# EAGLE schematic backplane_v1.0-smd (EAGLE 6.6.0)
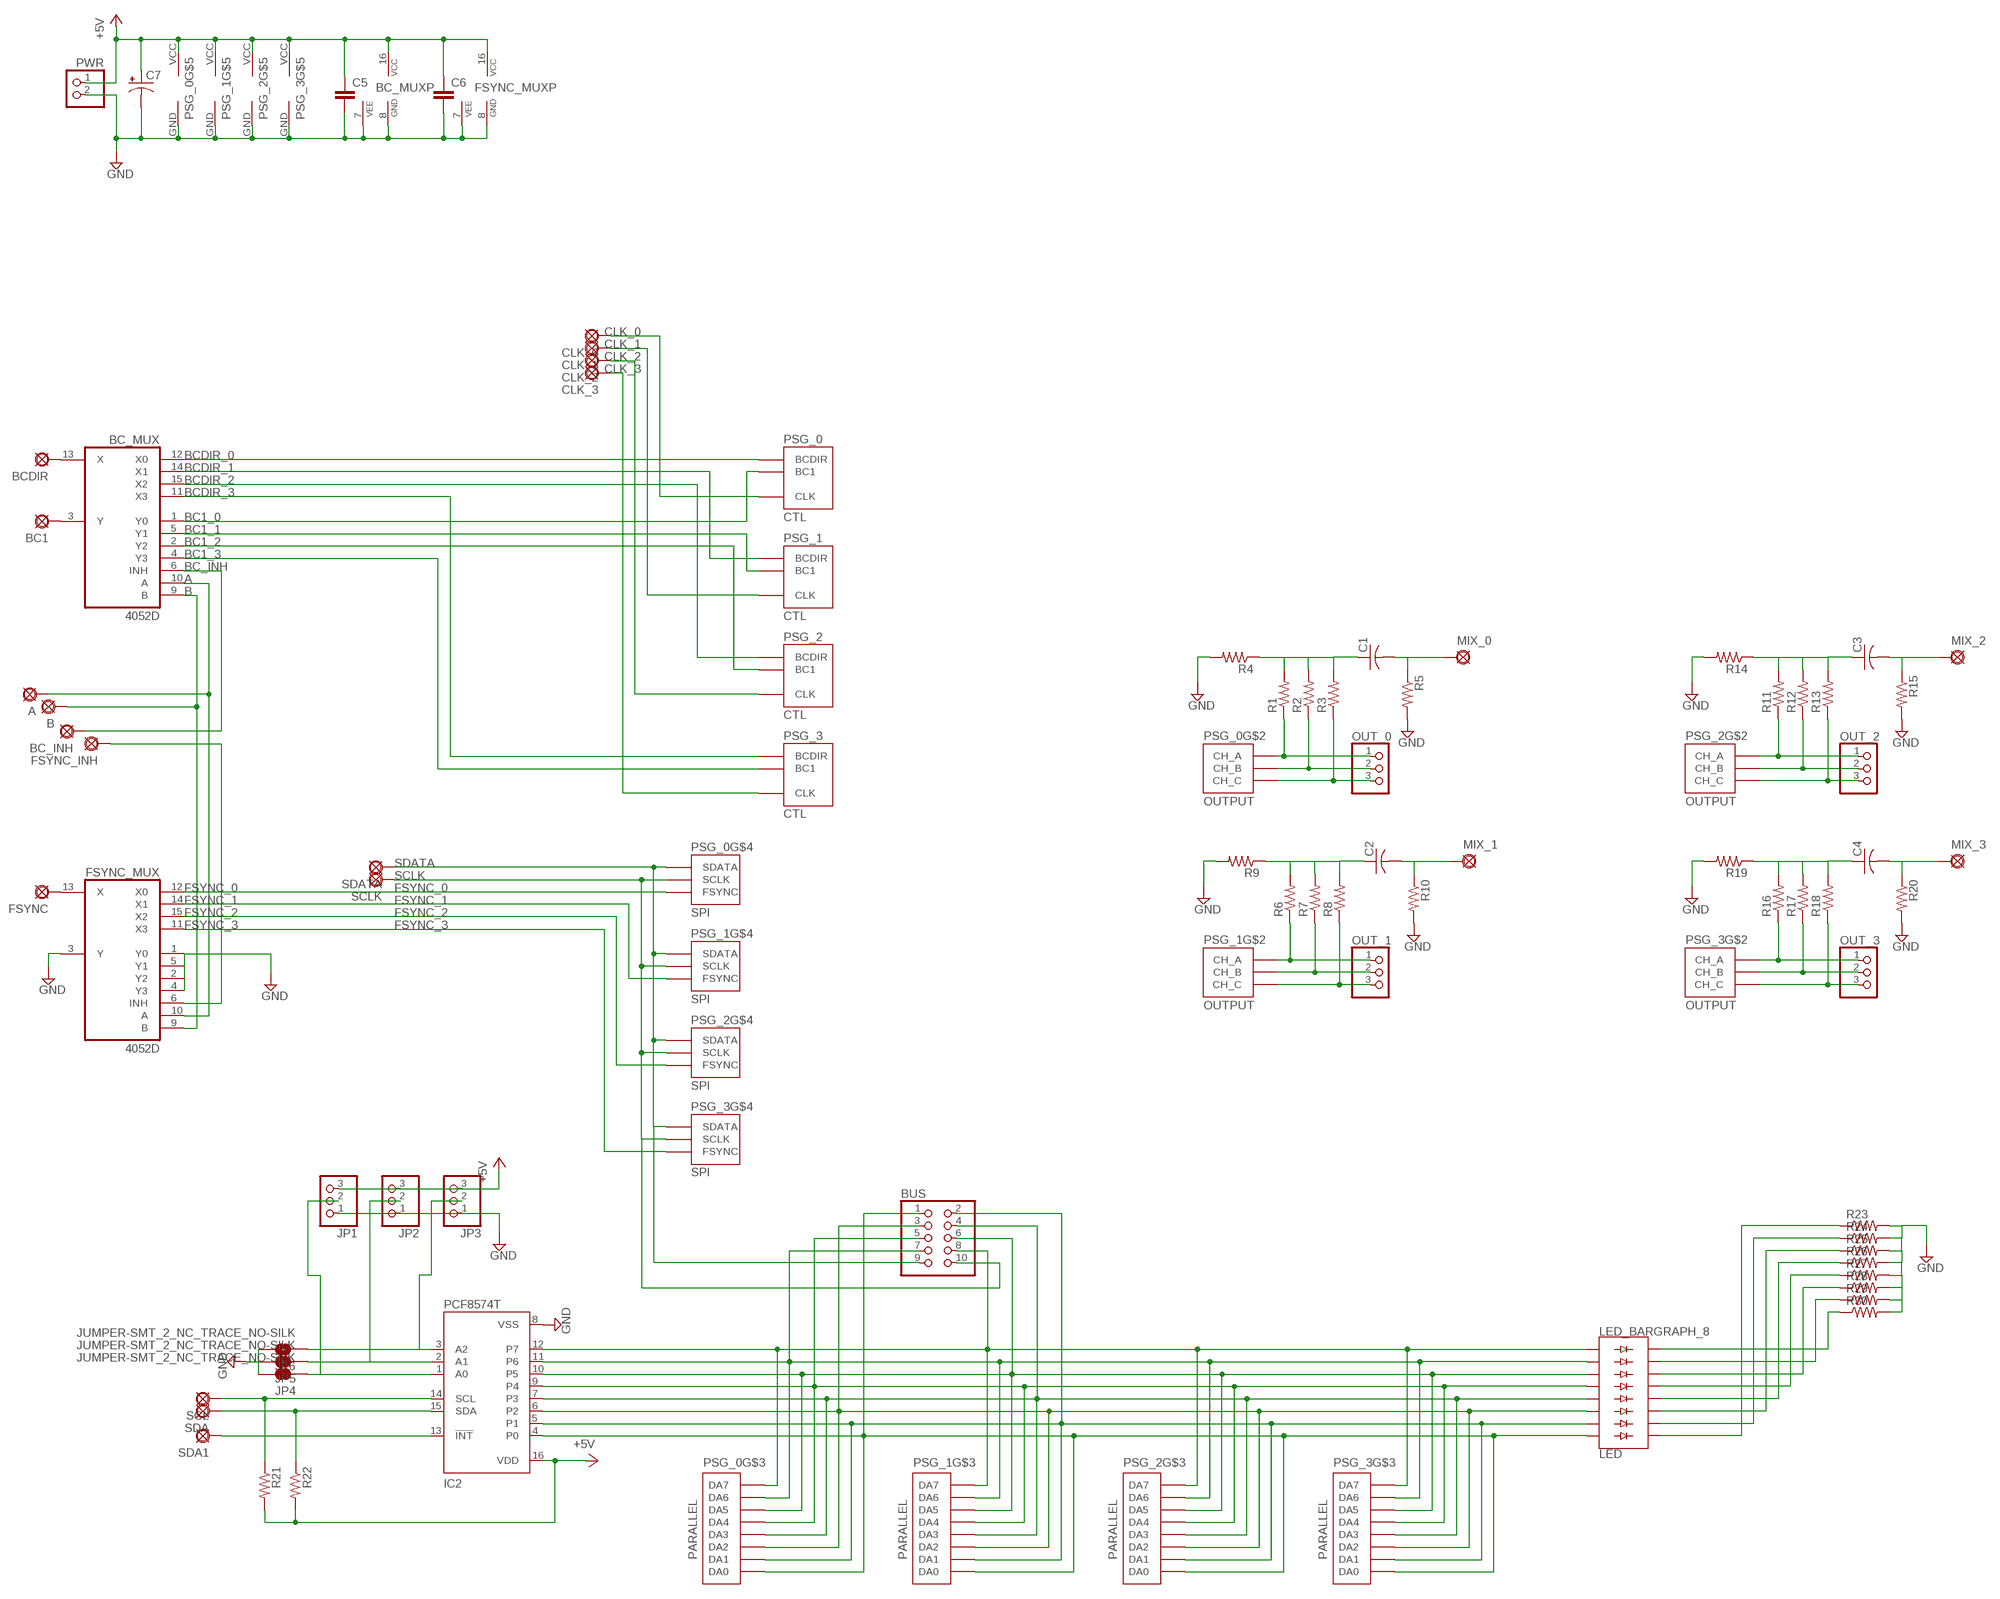
[diagram p0: schematic, sheet 1]

## Parts
A  PAD  [SQUARE]
B  PAD  [SQUARE]
BC1  PAD  [SQUARE]
BC_INH  PAD  [SQUARE]
BC_MUX  4052D  [SO16]
BCDIR  PAD  [SQUARE]
BUS  PINHD-2X5IDC  [10PIN_IDC]
C1  C-USC0805  [C0805]
C2  C-USC0805  [C0805]
C3  C-USC0805  [C0805]
C4  C-USC0805  [C0805]
C5  050X030_0251  [050X030_025]
C6  050X030_0251  [050X030_025]
C7  0631  [063_025]
CLK_0  PAD  [SQUARE]
CLK_1  PAD  [SQUARE]
CLK_2  PAD  [SQUARE]
CLK_3  PAD  [SQUARE]
FSYNC  PAD  [SQUARE]
FSYNC_INH  PAD  [SQUARE]
FSYNC_MUX  4052D  [SO16]
IC2  PCF8574T  [SO16W]
JP1  PINHD-1X3  [1X03]
JP2  PINHD-1X3  [1X03]
JP3  PINHD-1X3  [1X03]
JP4  JUMPER-SMT_2_NC_TRACE_NO-SILK  [SMT-JUMPER_2_NC_TRACE_NO-SILK]
JP5  JUMPER-SMT_2_NC_TRACE_NO-SILK  [SMT-JUMPER_2_NC_TRACE_NO-SILK]
JP6  JUMPER-SMT_2_NC_TRACE_NO-SILK  [SMT-JUMPER_2_NC_TRACE_NO-SILK]
LED  LED_BARGRAPH_8  [LED_BARGRAPH_8]
MIX_0  PAD  [SQUARE]
MIX_1  PAD  [SQUARE]
MIX_2  PAD  [SQUARE]
MIX_3  PAD  [SQUARE]
OUT_0  PINHD-1X3  [1X03]
OUT_1  PINHD-1X3  [1X03]
OUT_2  PINHD-1X3  [1X03]
OUT_3  PINHD-1X3  [1X03]
PSG_0  PSG_DAUGHTER  [PSG_DAUGHTER]
PSG_1  PSG_DAUGHTER  [PSG_DAUGHTER]
PSG_2  PSG_DAUGHTER  [PSG_DAUGHTER]
PSG_3  PSG_DAUGHTER  [PSG_DAUGHTER]
PWR  PINHD-1X2  [1X02]
R1  R-US_R0805  [R0805]
R2  R-US_R0805  [R0805]
R3  R-US_R0805  [R0805]
R4  R-US_R0805  [R0805]
R5  R-US_R0805  [R0805]
R6  R-US_R0805  [R0805]
R7  R-US_R0805  [R0805]
R8  R-US_R0805  [R0805]
R9  R-US_R0805  [R0805]
R10  R-US_R0805  [R0805]
R11  R-US_R0805  [R0805]
R12  R-US_R0805  [R0805]
R13  R-US_R0805  [R0805]
R14  R-US_R0805  [R0805]
R15  R-US_R0805  [R0805]
R16  R-US_R0805  [R0805]
R17  R-US_R0805  [R0805]
R18  R-US_R0805  [R0805]
R19  R-US_R0805  [R0805]
R20  R-US_R0805  [R0805]
R21  R-US_R0805  [R0805]
R22  R-US_R0805  [R0805]
R23  R-US_R0805  [R0805]
R24  R-US_R0805  [R0805]
R25  R-US_R0805  [R0805]
R26  R-US_R0805  [R0805]
R27  R-US_R0805  [R0805]
R28  R-US_R0805  [R0805]
R29  R-US_R0805  [R0805]
R30  R-US_R0805  [R0805]
SCL  PAD  [SQUARE]
SCLK  PAD  [SQUARE]
SDA  PAD  [SQUARE]
SDA1  PAD  [SQUARE]
SDATA  PAD  [SQUARE]

## Nets
+5V: BC_MUX.16(VCC) C5.1 C6.1 C7.+ FSYNC_MUX.16(VCC) IC2.16(VDD) JP1.3 JP2.3 JP3.3 PSG_0.VCC PSG_1.VCC PSG_2.VCC PSG_3.VCC PWR.1 R21.2 R22.2
A: A.1(PAD) BC_MUX.10(A) FSYNC_MUX.10(A)
A0: IC2.1(A0) JP1.2 JP4.1
A1: IC2.2(A1) JP2.2 JP5.1
A2: IC2.3(A2) JP3.2 JP6.1
B: B.1(PAD) BC_MUX.9(B) FSYNC_MUX.9(B)
BC1_0: BC_MUX.1(Y0) PSG_0.BC1
BC1_1: BC_MUX.5(Y1) PSG_1.BC1
BC1_2: BC_MUX.2(Y2) PSG_2.BC1
BC1_3: BC_MUX.4(Y3) PSG_3.BC1
BC_INH: BC_INH.1(PAD) BC_MUX.6(INH)
BCDIR_0: BC_MUX.12(X0) PSG_0.BCDIR
BCDIR_1: BC_MUX.14(X1) PSG_1.BCDIR
BCDIR_2: BC_MUX.15(X2) PSG_2.BCDIR
BCDIR_3: BC_MUX.11(X3) PSG_3.BCDIR
CLK_0: CLK_0.1(PAD) PSG_0.CLK
CLK_1: CLK_1.1(PAD) PSG_1.CLK
CLK_2: CLK_2.1(PAD) PSG_2.CLK
CLK_3: CLK_3.1(PAD) PSG_3.CLK
FSYNC: FSYNC.1(PAD) FSYNC_MUX.13(X)
FSYNC_0: FSYNC_MUX.12(X0) PSG_0.FSYNC
FSYNC_1: FSYNC_MUX.14(X1) PSG_1.FSYNC
FSYNC_2: FSYNC_MUX.15(X2) PSG_2.FSYNC
FSYNC_3: FSYNC_MUX.11(X3) PSG_3.FSYNC
FSYNC_INH: FSYNC_INH.1(PAD) FSYNC_MUX.6(INH)
GND: BC_MUX.7(VEE) BC_MUX.8(GND) C5.2 C6.2 C7.- FSYNC_MUX.1(Y0) FSYNC_MUX.2(Y2) FSYNC_MUX.3(Y) FSYNC_MUX.4(Y3) FSYNC_MUX.5(Y1) FSYNC_MUX.7(VEE) FSYNC_MUX.8(GND) IC2.8(VSS) JP1.1 JP2.1 JP3.1 JP4.2 JP5.2 JP6.2 PSG_0.GND PSG_1.GND PSG_2.GND PSG_3.GND PWR.2 R4.2 R5.2 R9.2 R10.2 R14.2 R15.2 R19.2 R20.2 R23.2 R24.2 R25.2 R26.2 R27.2 R28.2 R29.2 R30.2
N$1: C1.1 R1.2 R2.2 R3.2 R4.1
N$2: BC_MUX.13(X) BCDIR.1(PAD)
N$3: BC1.1(PAD) BC_MUX.3(Y)
N$4: IC2.14(SCL) R21.1 SCL.1(PAD)
N$5: C1.2 MIX_0.1(PAD) R5.1
N$6: IC2.15(SDA) R22.1 SDA.1(PAD)
N$8: C2.1 R6.2 R7.2 R8.2 R9.1
N$9: C2.2 MIX_1.1(PAD) R10.1
N$12: IC2.13(!INT) SDA1.1(PAD)
N$13: C3.1 R11.2 R12.2 R13.2 R14.1
N$14: C3.2 MIX_2.1(PAD) R15.1
N$15: LED.C7 R30.1
N$16: BUS.8 IC2.12(P7) LED.A7 PSG_0.DA7 PSG_1.DA7 PSG_2.DA7 PSG_3.DA7
N$17: BUS.1 IC2.4(P0) LED.A0 PSG_0.DA0 PSG_1.DA0 PSG_2.DA0 PSG_3.DA0
N$18: BUS.2 IC2.5(P1) LED.A1 PSG_0.DA1 PSG_1.DA1 PSG_2.DA1 PSG_3.DA1
N$19: BUS.3 IC2.6(P2) LED.A2 PSG_0.DA2 PSG_1.DA2 PSG_2.DA2 PSG_3.DA2
N$20: BUS.4 IC2.7(P3) LED.A3 PSG_0.DA3 PSG_1.DA3 PSG_2.DA3 PSG_3.DA3
N$21: BUS.5 IC2.9(P4) LED.A4 PSG_0.DA4 PSG_1.DA4 PSG_2.DA4 PSG_3.DA4
N$22: BUS.6 IC2.10(P5) LED.A5 PSG_0.DA5 PSG_1.DA5 PSG_2.DA5 PSG_3.DA5
N$23: BUS.7 IC2.11(P6) LED.A6 PSG_0.DA6 PSG_1.DA6 PSG_2.DA6 PSG_3.DA6
N$24: OUT_0.1 PSG_0.OUT_A(CH_A) R1.1
N$25: OUT_0.2 PSG_0.OUT_B(CH_B) R2.1
N$26: OUT_0.3 PSG_0.OUT_C(CH_C) R3.1
N$27: OUT_1.1 PSG_1.OUT_A(CH_A) R6.1
N$28: OUT_1.2 PSG_1.OUT_B(CH_B) R7.1
N$29: OUT_1.3 PSG_1.OUT_C(CH_C) R8.1
N$30: OUT_2.1 PSG_2.OUT_A(CH_A) R11.1
N$31: OUT_2.2 PSG_2.OUT_B(CH_B) R12.1
N$32: OUT_2.3 PSG_2.OUT_C(CH_C) R13.1
N$33: OUT_3.1 PSG_3.OUT_A(CH_A) R16.1
N$34: OUT_3.2 PSG_3.OUT_B(CH_B) R17.1
N$35: OUT_3.3 PSG_3.OUT_C(CH_C) R18.1
N$36: LED.C6 R29.1
N$37: LED.C5 R28.1
N$38: C4.1 R16.2 R17.2 R18.2 R19.1
N$39: C4.2 MIX_3.1(PAD) R20.1
N$40: LED.C4 R27.1
N$41: LED.C3 R26.1
N$42: LED.C2 R25.1
N$43: LED.C1 R24.1
N$44: LED.C0 R23.1
SCLK: BUS.10 PSG_0.SCLK PSG_1.SCLK PSG_2.SCLK PSG_3.SCLK SCLK.1(PAD)
SDATA: BUS.9 PSG_0.SDATA PSG_1.SDATA PSG_2.SDATA PSG_3.SDATA SDATA.1(PAD)

## Library data of the parts
A B BC1 BC_INH BCDIR CLK_0 CLK_1-CLK_3 FSYNC FSYNC_INH MIX_0 MIX_1-MIX_3 SCL SCLK SDA SDA1 SDATA = gm-supply:PAD: PAD use this package for pads with any purpose, including input, output, send or return various pad shapes: round, square, octogonal, long, and long offset
BC_MUX FSYNC_MUX = 40xx:4052: Dual 4-channel ANALOG MULTIPLEXER
BUS = jaapie:PINHD-2X5: PIN HEADER
C1-C4 = resistor:C-US: CAPACITOR, American symbol
C5 C6 = gm-caps-ceramic:050X030_025: 47 - 120pF Xicon Ceramic Disc 2.5mm lead spacing
C7 = gm-caps-electro-pol:063: 33 - 220uF Xicon values at Mouser.com 10V: 220uF; 16V: 100uF; 25V: 100uF; 50V: 33uF
IC2 = micro-philips:PCF8574: I2C-Bus Remote 8-bit I/O expander http://www.semiconductors.philips.com/acrobat_download/datasheets/PCF8574_4.pdf; MPN: PCF8574T/3,512; OC_FARNELL: 1201255; OC_NEWARK: 70R6870
JP1-JP3 OUT_0 OUT_1-OUT_3 = pinhead:PINHD-1X3: PIN HEADER
JP4-JP6 = SparkFun-Jumpers:JUMPER-SMT_2_NC_TRACE: Normally closed trace jumper This jumper has a trace between two pads so it's normally closed (NC). Use a razor knife to open the connection. For best results follow the IPC guidelines for cutting traces: Cutout at least 0.063 mm (0.005 in). Remove all loose material to clean up the cut area. Seal the cut with an approved epoxy. Reapply solder to reclose the connection.
LED = jaapie:LED_BARGRAPH_8
PSG_0 PSG_1-PSG_3 = jaapie:PSG_DAUGHTER
PWR = pinhead:PINHD-1X2: PIN HEADER
R1-R30 = resistor:R-US_: RESISTOR, American symbol